# Altium schematic sheet RS485.SchDoc
size A4; SheetNumber: 4; SheetTotal: 7
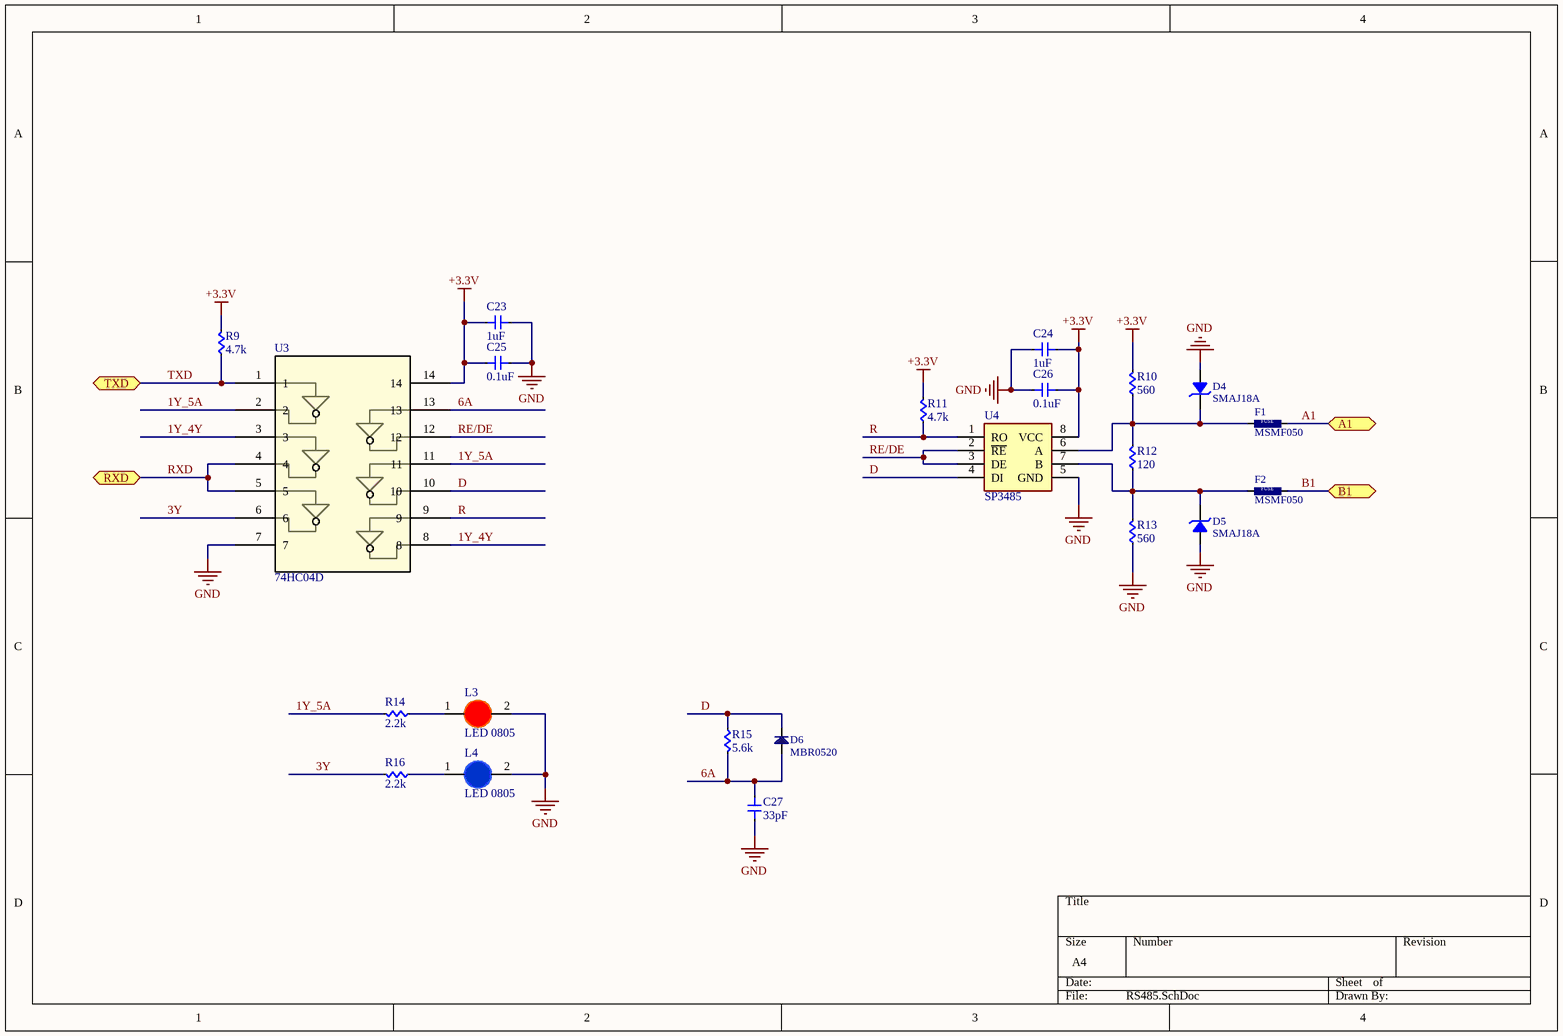
[diagram p0: RS485.SchDoc]

## Parts
C23  1uF  [Cap 0603]
C24  1uF  [Cap 0603]
C25  0.1uF  [Cap 0603]
C26  0.1uF  [Cap 0603]
C27  33pF  [Cap 0603]
D4  SMAJ18A  [DO-214AC,SMA]
D5  SMAJ18A  [DO-214AC,SMA]
D6  MBR0520  [SOD-123]
F1  MSMF050  [FUSE_PTC]
F2  MSMF050  [FUSE_PTC]
L3  LED 0805  [LED-0805-Red]
L4  LED 0805  [LED-0805-Blue]
R9  4.7k  [RES 0603]
R10  560  [RES 0805]
R11  4.7k  [RES 0603]
R12  120  [RES 0805]
R13  560  [RES 0805]
R14  2.2k  [RES 0603]
R15  5.6k  [RES 0603]
R16  2.2k  [RES 0603]
U3  74HC04D  [SOIC14_50_285_80X25_SMT]
U4  SP3485  [SOIC8_50_328_25X90_SMT]

## Ports
A1 (bidir), B1 (bidir), RXD (bidir), TXD (bidir)

## Nets
+3.3V: C23.1 C24.1 C25.1 C26.1 R9.2 R10.2 R11.2 U3.14 U4.8(VCC)
GND: C23.2 C24.2 C25.2 C26.2 C27.1 D4.1(A) D5.1(A) L3.2(K) L4.2(K) R13.1 U3.7 U4.5(GND)
1Y_4Y: U3.3 U3.8
1Y_5A: R14.2 U3.2 U3.11
3Y: R16.2 U3.6
6A: C27.2 D6.1(A) R15.2 U3.13
A1: F1.2 ; port A1
B1: F2.2 ; port B1
D: D6.2(K) R15.1 U3.10 U4.4(DI)
R: R11.1 U3.9 U4.1(RO)
RE/DE: U3.12 U4.2(~{RE}) U4.3(DE)
RXD: U3.4 U3.5 ; port RXD
TXD: R9.1 U3.1 ; port TXD
NetD4_2: D4.2(K) F1.1 R10.1 R12.2 U4.6(A)
NetD5_2: D5.2(K) F2.1 R12.1 R13.2 U4.7(B)
NetL3_1: L3.1(A) R14.1
NetL4_1: L4.1(A) R16.1

## Notes on the sheet
- (in symbol Fuse_smd) FUSE

## Library data of the parts
C23-C27 = Cap 0603: Capacitor SMD 0603
D4 D5 = Diode_TVS: Zener Diode; Published: 8-Jun-2000; LatestRevisionDate: 17-Jul-2002; LatestRevisionNote: Re-released for DXP Platform.; PackageReference: DIODE-0.7; Publisher: Altium Limited; PackageDescription: Diode, Thru-Hole; 2 Leads; 0.7 in Pin Spacing
D6 = Didode_MBR0520: Vendor: Digikey; Value: FR307; Current: 3Amp; Published: 8-Jun-2000; LatestRevisionDate: 17-Jul-2002; LatestRevisionNote: Re-released for DXP Platform.; DatasheetDocument: 1997; PackageReference: DO-35; Publisher: Altium Limited; Code_JEDEC: DO-204-AH; ComponentLink1Description: Digikey Part Link; ComponentLink1URL: http://www.fairchildsemi.com/; ComponentLink2Description: Open Datasheet; ComponentLink2URL: H:\LIBRARY\LIBRARY.Datasheet\ds26003.pdf
F1 F2 = Fuse_smd
L3 = LED 0805 Do: Dán; Don_Vi: Con; Ma_Hang: MH000897; Ten_Linh_Kien: LED 0805 Màu Đỏ (Red); Ghi_Chu: *; Kieu_Chan: *; Chung_Loai: Dán
L4 = LED 0805 Xanh Duong: Dán; Don_Vi: Con; Ma_Hang: MH002327; Ten_Linh_Kien: LED 0805 Màu Xanh Dương (Blue); Ghi_Chu: *; Kieu_Chan: *; Chung_Loai: Dán
R9 R11 R14-R16 = RES 0603: RES SMD 0603; Manufacturer: Vishay Dale; Manufacturer Part Number: CRCW040210K0FKED; Resistance (Ohms): 10k; Tolerance: ±1%; Power (Watts): 0.063W, 1/16W; Temperature Coefficient: ±100ppm/°C; Supplier 1: Digi-Key; RoHS: RoHS Compliant; Category: Resistors; Stock 1: 2392462; Pricing 1: 10=0.083, 50=0.0444, 200=0.0255, 1000=0.0174 (USD); Packaging: Cut Tape (CT); Composition: Thick Film; Features: Automotive AEC-Q200; Operating Temperature: -55°C ~ 155°C; Package / Case: 0402 (1005 Metric); Supplier Device Package: 0402 (1005 Metric); Size / Dimension: 0.039" L x 0.020" W (1.00mm x 0.50mm); Height: 0.016" (0.40mm); Number of Terminations: 2; ComponentLink1URL: http://www.vishay.com/docs/20035/dcrcwe3.pdf; ComponentLink1Description: http://www.vishay.com/docs/20035/dcrcwe3.pdf; Supplier Part Number 1: 541-10.0KLCT-ND
R10 R12 R13 = RES 0805: RES SMD 0805; Manufacturer: Vishay Dale; Manufacturer Part Number: CRCW040210K0FKED; Resistance (Ohms): 10k; Tolerance: ±1%; Power (Watts): 0.063W, 1/16W; Temperature Coefficient: ±100ppm/°C; Supplier 1: Digi-Key; RoHS: RoHS Compliant; Category: Resistors; Stock 1: 2392462; Pricing 1: 10=0.083, 50=0.0444, 200=0.0255, 1000=0.0174 (USD); Packaging: Cut Tape (CT); Composition: Thick Film; Features: Automotive AEC-Q200; Operating Temperature: -55°C ~ 155°C; Package / Case: 0402 (1005 Metric); Supplier Device Package: 0402 (1005 Metric); Size / Dimension: 0.039" L x 0.020" W (1.00mm x 0.50mm); Height: 0.016" (0.40mm); Number of Terminations: 2; ComponentLink1URL: http://www.vishay.com/docs/20035/dcrcwe3.pdf; ComponentLink1Description: http://www.vishay.com/docs/20035/dcrcwe3.pdf; Supplier Part Number 1: 541-10.0KLCT-ND
U3 = 74HC04D: Hex Inverter, SOIC14; Manufacturer_Name: Toshiba Electronic Devices & Storage Corp.; Copyright: Copyright (C) 2025 Ultra Librarian. All rights reserved.; Manufacturer_Part_Number: 74HC04D; RefDes: RefDes; Type: Type